# EAGLE design pmu (EAGLE 6.4)
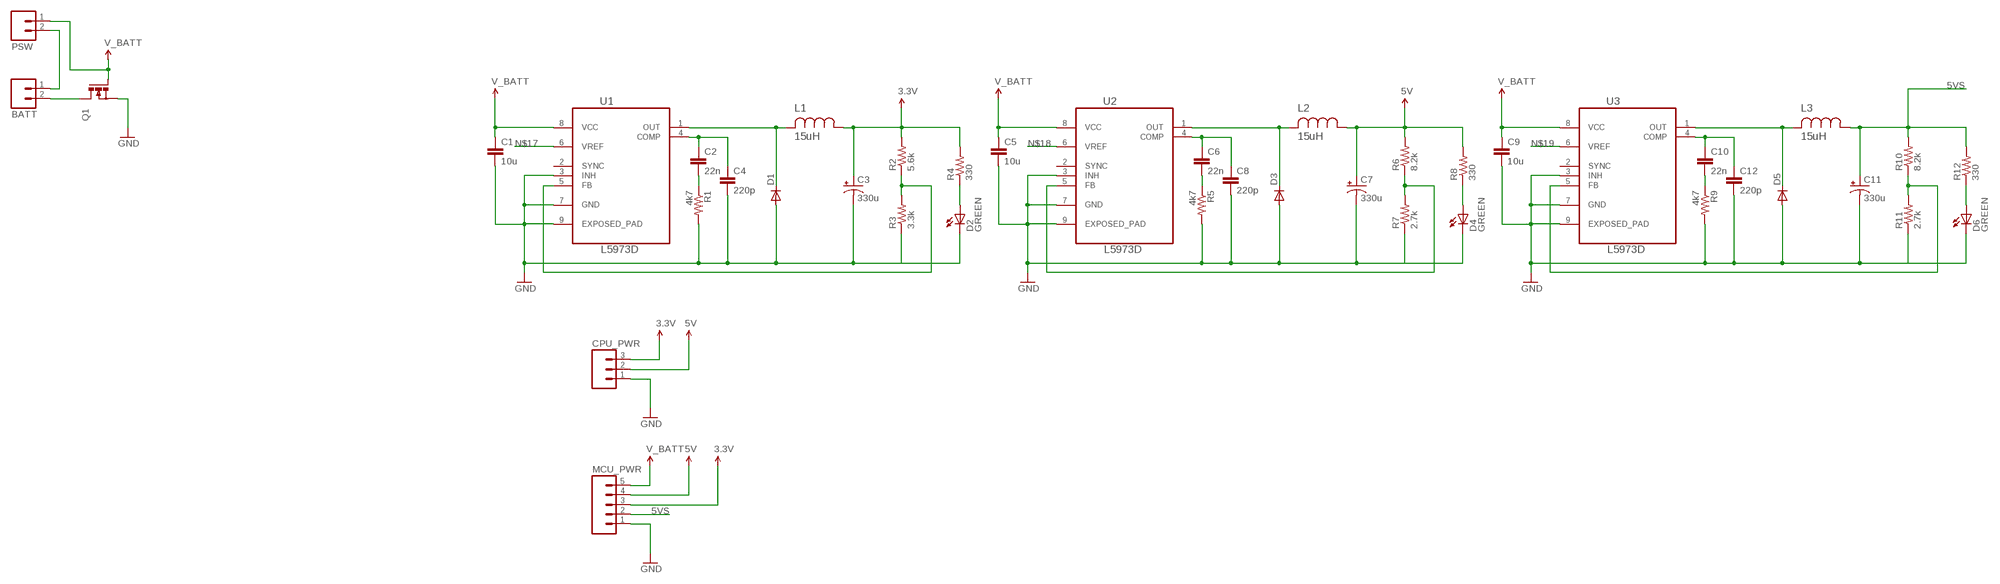
[diagram p0: schematic, sheet 1]

## Parts
BATT  M02PTH  [1X02]
C1  10u  CAP1210  [1210]
C2  22n  CAP0805  [0805]
C3  330u  CPOL-USE  [PANASONIC_E]
C4  220p  CAP0805  [0805]
C5  10u  CAP1210  [1210]
C6  22n  CAP0805  [0805]
C7  330u  CPOL-USE  [PANASONIC_E]
C8  220p  CAP0805  [0805]
C9  10u  CAP1210  [1210]
C10  22n  CAP0805  [0805]
C11  330u  CPOL-USE  [PANASONIC_E]
C12  220p  CAP0805  [0805]
CPU_PWR  M03PTH  [1X03]
D1  DIODESMB  [SMB-DIODE]
D2  GREEN  LED-GREENLARGE  [LED-1206]
D3  DIODESMB  [SMB-DIODE]
D4  GREEN  LED-GREENLARGE  [LED-1206]
D5  DIODESMB  [SMB-DIODE]
D6  GREEN  LED-GREENLARGE  [LED-1206]
L1  15uH  ELL8TP150MB-8TP  [IND_ELL8TP]
L2  15uH  ELL8TP150MB-8TP  [IND_ELL8TP]
L3  15uH  ELL8TP150MB-8TP  [IND_ELL8TP]
MCU_PWR  M05PTH  [1X05]
PSW  M02PTH  [1X02]
Q1  N-MOSFET-SO8S  [SO-08]
R1  4k7  RESISTOR0805-RES  [0805]
R2  5.6k  RESISTOR0805-RES  [0805]
R3  3.3k  RESISTOR0805-RES  [0805]
R4  330  RESISTOR0805-RES  [0805]
R5  4k7  RESISTOR0805-RES  [0805]
R6  8.2k  RESISTOR0805-RES  [0805]
R7  2.7k  RESISTOR0805-RES  [0805]
R8  330  RESISTOR0805-RES  [0805]
R9  4k7  RESISTOR0805-RES  [0805]
R10  8.2k  RESISTOR0805-RES  [0805]
R11  2.7k  RESISTOR0805-RES  [0805]
R12  330  RESISTOR0805-RES  [0805]
U1  L5973D  [SOP127P600X170-9N]
U2  L5973D  [SOP127P600X170-9N]
U3  L5973D  [SOP127P600X170-9N]

## Nets
3.3V: C3.+ CPU_PWR.3 L1.1 MCU_PWR.3 R2.2 R4.2
5V: C7.+ CPU_PWR.2 L2.1 MCU_PWR.4 R6.2 R8.2
5VS: C11.+ L3.1 MCU_PWR.2 R10.2 R12.2
GND: C1.2 C3.- C4.2 C5.2 C7.- C8.2 C9.2 C11.- C12.2 CPU_PWR.1 D1.A D2.C D3.A D4.C D5.A D6.C MCU_PWR.1 Q1.1(S) Q1.2(S) Q1.3(S) R1.2 R3.1 R5.2 R7.1 R9.2 R11.1 U1.3(INH) U1.7(GND) U1.9(EXPOSED_PAD) U2.3(INH) U2.7(GND) U2.9(EXPOSED_PAD) U3.3(INH) U3.7(GND) U3.9(EXPOSED_PAD)
N$1: C2.1 C4.1 U1.4(COMP)
N$2: C2.2 R1.1
N$3: D1.C L1.2 U1.1(OUT)
N$4: BATT.2 Q1.5(D) Q1.6(D) Q1.7(D) Q1.8(D)
N$5: R2.1 R3.2 U1.5(FB)
N$6: D2.A R4.1
N$7: C10.1 C12.1 U3.4(COMP)
N$8: C6.1 C8.1 U2.4(COMP)
N$9: C6.2 R5.1
N$10: D3.C L2.2 U2.1(OUT)
N$11: R6.1 R7.2 U2.5(FB)
N$12: D4.A R8.1
N$13: C10.2 R9.1
N$14: D5.C L3.2 U3.1(OUT)
N$15: R10.1 R11.2 U3.5(FB)
N$16: D6.A R12.1
N$17: U1.6(VREF)
N$18: U2.6(VREF)
N$19: U3.6(VREF)
N$22: BATT.1 PSW.2
V_BATT: C1.1 C5.1 C9.1 MCU_PWR.5 PSW.1 Q1.4(G) U1.8(VCC) U2.8(VCC) U3.8(VCC)
Unconnected: U1.2(SYNC) U2.2(SYNC) U3.2(SYNC)

## Library data of the parts
BATT PSW = SparkFun-Connectors:M02: Standard 2-pin 0.1" header. Use with - straight break away headers ( PRT-00116) - right angle break away headers (PRT-00553) - swiss pins (PRT-00743) - machine pins (PRT-00117) - female headers (PRT-00115) Molex polarized connector foot print use with: PRT-08233 with associated crimp pins and housings. 2.54_SCREWTERM for use with PRT-10571. 3.5mm Screw Terminal footprints for PRT-08084 5mm Screw Terminal footprints for use with PRT-08433
C1 C2 C4-C6 C8-C10 C12 = SparkFun-Passives:CAP: Capacitor Standard 0603 ceramic capacitor, and 0.1" leaded capacitor.
C3 C7 C11 = rcl:CPOL-US: POLARIZED CAPACITOR, American symbol
CPU_PWR = SparkFun-Connectors:M03: Header 3 Standard 3-pin 0.1" header. Use with straight break away headers (SKU : PRT-00116), right angle break away headers (PRT-00553), swiss pins (PRT-00743), machine pins (PRT-00117), and female headers (PRT-00115). Molex polarized connector foot print use with SKU : PRT-08232 with associated crimp pins and housings.
D1 D3 D5 = SparkFun-DiscreteSemi:DIODE: Diode These are standard reverse protection diodes and small signal diodes. SMA package can handle up to about 1A. SOD-323 can handle about 200mA. What the SOD-323 package when ordering, there are some mfgs out there that are 5-pin packages.
D2 D4 D6 = SparkFun-LED:LED-GREEN: Various green LEDs 0603- DIO-00821 LARGE- DIO-00862 LILYPAD- DIO-09910; PROD_ID: DIO-00862
L1-L3 = Panasonic-ELL:ELL: Choke Coils; CURRENTRATING: 2.3A; MPN: ELL8TP150MB; OC_FARNELL: 1865673; OC_NEWARK: 56T0928; PACKAGE: SMD; SUPPLIER: PANASONIC; VALUE: 15UH
MCU_PWR = SparkFun-Connectors:M05: Header 5 Standard 5-pin 0.1" header. Use with straight break away headers (SKU : PRT-00116), right angle break away headers (PRT-00553), swiss pins (PRT-00743), machine pins (PRT-00117), and female headers (PRT-00115). Molex polarized connector foot print use with SKU : PRT-08230 with associated crimp pins and housings.
Q1 = transistor-power:N-MOSFET-SO8: N-Channel MOSFET Example: FDS7760A; N-Channel Logic Level PowerTrench® MOSFET FDS2572; N-Channel UltraFET® Trench MOSFET Source: www.fairchildsemi.com
R1-R12 = SparkFun-Passives:RESISTOR: Resistor Basic schematic elements and footprints for 0603, 1206, and PTH resistors.
U1-U3 = L5973D:L5973D: 2.5 A switch step down switching regulator; MPN: L5973D; OC_FARNELL: 1077145; OC_NEWARK: 05M3335; PACKAGE: HSOP8; SUPPLIER: STMICROELECTRONICS

## Board
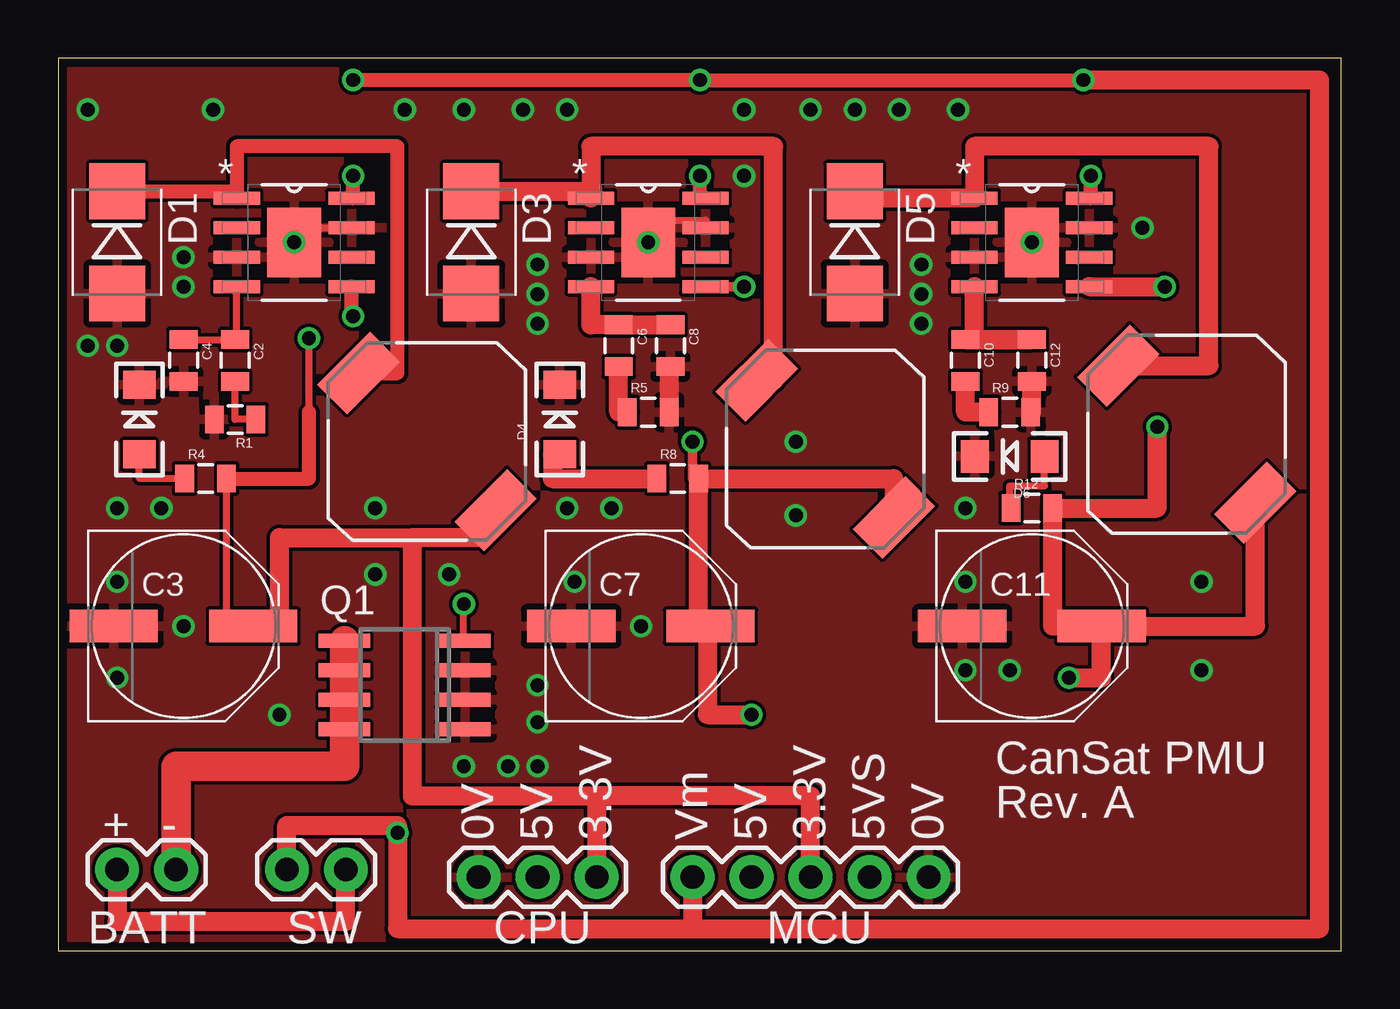
[diagram p1: board, top side]
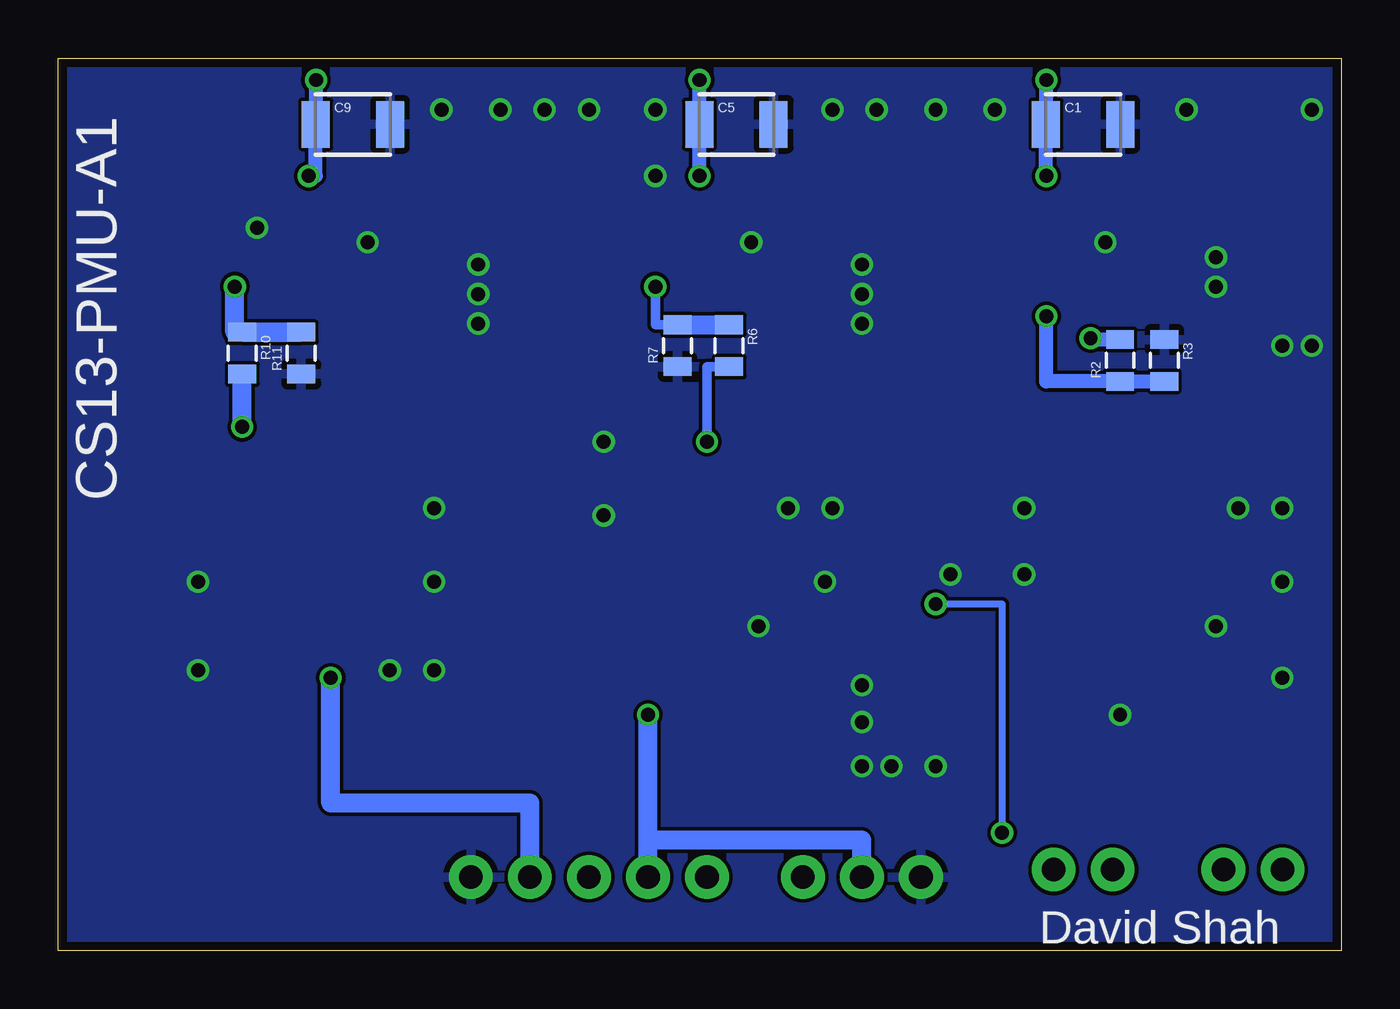
[diagram p2: board, bottom side, seen from below]

Size 55.23 x 38.41 mm. Coordinates in mm from the lower left corner, seen from the top.
Outline: 0,0 55.23,0 55.23,38.41 0,38.41 0,0
Copper layers (1*16): Top 0.0356mm / dielectric 1.5011mm / Bottom 0.0356mm
Design rules "LaenPCBOrder *": minimum track width 6mil, minimum drill 13mil, track to track 6mil, track to pad 6mil, pad to pad 6mil, via to via 6mil, smd to smd 6mil, copper to edge 15mil, drill to drill 6mil, minimum pad ring 7mil, minimum via ring 7mil, stop-mask expansion 4mil, vias tented up to drill 28mil, thermal gap 10mil

### Footprints (pad centres in the part's own frame; a part is rotated, then mirrored left to right if it is on the bottom)
1X02 = drill 1.016 pad 1.88: 1 0,0; 2 2.54,0
1210 = smd 1.2 x 2: 1 -1.6,0; 2 1.6,0
0805 = smd 0.8 x 1.2: 1 -0.9,0; 2 0.9,0
PANASONIC_E = smd 3.8 x 1.4: + 3,0; - -3,0
1X03 = drill 1.016 pad 1.88: 1 0,0; 2 2.54,0; 3 5.08,0
SMB-DIODE = smd 2.4 x 2.4: A 2.2,0; C -2.2,0
LED-1206 = smd 1.2 x 1.4: A -1.5,0; C 1.5,0
IND_ELL8TP = smd 1.8 x 3.2 rotated 45: 1 -2.95,-2.95; 2 2.95,2.95
1X05 = drill 1.016 pad 1.88: 1 0,0; 2 2.54,0; 3 5.08,0; 4 7.62,0; 5 10.16,0
SO-08 = smd 0.6 x 2.2: 1 -1.905,-2.6; 2 -0.635,-2.6; 3 0.635,-2.6; 4 1.905,-2.6; 5 1.905,2.6; 6 0.635,2.6; 7 -0.635,2.6; 8 -1.905,2.6
SOP127P600X170-9N = smd 1.981 x 0.559: 1 -2.464,1.905; 2 -2.464,0.635; 3 -2.464,-0.635; 4 -2.464,-1.905; 5 2.464,-1.905; 6 2.464,-0.635; 7 2.464,0.635; 8 2.464,1.905 | smd 2.311 x 2.997: 9 0,0

### Placement (x,y rotation side)
BATT  2.54,3.49 0 top
C1  11.11,35.56 0 bottom
C2  7.62,25.4 270 top
C3  5.4,13.97 0 top
C4  5.4,25.4 270 top
C5  26.04,35.56 0 bottom
C6  24.13,26.04 270 top
C7  25.08,13.97 0 top
C8  26.35,26.04 270 top
C9  42.55,35.56 0 bottom
C10  39.05,25.4 270 top
C11  41.91,13.97 0 top
C12  41.91,25.4 270 top
CPU_PWR  18.1,3.17 0 top
D1  2.54,30.48 270 top
D2  3.49,22.86 90 top
D3  17.78,30.48 270 top
D4  21.59,22.86 90 top
D5  34.29,30.48 270 top
D6  40.96,21.27 180 top
L1  15.88,21.91 90 top
L2  33.02,21.59 90 top
L3  48.58,22.23 90 top
MCU_PWR  37.47,3.17 180 top
PSW  9.84,3.49 0 top
Q1  14.92,11.43 90 top
R1  7.62,22.86 180 top
R2  9.53,25.4 90 bottom
R3  7.62,25.4 270 bottom
R4  6.35,20.32 0 top
R5  25.4,23.18 0 top
R6  26.35,26.04 270 bottom
R7  28.57,26.04 90 bottom
R8  26.67,20.32 0 top
R9  40.96,23.18 0 top
R10  47.31,25.72 270 bottom
R11  44.77,25.72 90 bottom
R12  41.91,19.05 0 top
U1  10.16,30.48 0 top
U2  25.4,30.48 0 top
U3  41.91,30.48 0 top

### Tracks (layer width: path | path; a pad name or v marks a point on that pad's centre or on a via)
3.3V  (via drill 0.6)
  Top 0.305: C3.+ 7.25,13.97 R4.2 | 10.79,23.18 v10.79,26.35
  Top 0.61: R4.2 10.79,20.32 10.79,23.18
  Top 0.813: C3.+ 9.53,13.97 9.53,17.78 15.24,17.78 | L1.1 18.19,17.78 15.24,17.78 | 15.24,17.78 15.24,6.67 23.18,6.67 | 23.18,6.67 CPU_PWR.3 | MCU_PWR.3 32.38,6.67 23.18,6.67
  Bottom 0.61: R2.2 10.79,26.3 v10.79,26.35
5V  (via drill 0.6)
  Top 0.406: R8.2 27.3,20.32 v27.3,21.91
  Top 0.813: L2.1 35.97,20.32 R8.2 27.57,13.97 C7.+ 27.94,13.97 27.94,10.16 v29.84,10.16
  Bottom 0.406: R6.2 27.3,25.14 v27.3,21.91
  Bottom 0.813: MCU_PWR.4 29.84,4.76 | 29.84,4.76 v29.84,10.16 | CPU_PWR.2 20.64,4.76 29.84,4.76
5VS  (via drill 0.6)
  Top 0.813: v43.5,11.75 44.91,11.75 C11.+ | C11.+ 51.53,13.97 L3.1 | C11.+ 42.81,13.97 R12.2 47.31,19.05 v47.31,22.54
  Bottom 0.813: MCU_PWR.2 34.92,6.35 43.5,6.35 v43.5,11.75 | v47.31,22.54 R10.2
GND  (via drill 0.6)
  Top 0.305: 9.53,29.53 9.53,30.48 U1.9 10.16,31.11 U1.7 | U2.7 27.86,31.43 26.04,31.43 26.04,30.48 U2.9 | U3.9 41.27,30.48 41.27,29.53
  Top 0.813: R9.2 41.91,23.18 C12.2 | C8.2 26.3,25.14 R5.2
  other vias: 10.16,30.48 25.4,30.48 41.91,30.48 2.54,19.05 4.45,19.05 21.91,19.05 23.81,19.05 39.05,19.05 1.27,36.2 6.67,36.2 14.92,36.2 17.46,36.2 20,36.2 21.91,36.2 29.53,36.2 32.38,36.2 34.29,36.2 36.2,36.2 38.73,36.2 37.15,29.53 37.15,28.26 37.15,26.99 29.53,33.34 20.64,28.26 20.64,29.53 20.64,26.99 17.46,7.94 20.64,7.94 19.37,7.94 46.67,31.11 31.75,21.91 31.75,18.73 1.27,26.04 2.54,26.04 5.4,29.84 5.4,28.57 5.4,13.97 2.54,15.88 2.54,11.75 9.53,10.16 13.65,19.05 13.65,16.19 16.83,16.19 20.64,9.84 20.64,11.43 22.23,15.88 39.05,15.88 39.05,12.06 40.96,12.06 25.08,13.97 49.21,15.88 49.21,12.06
  pour Top: -0.32,39.05 -0.32,-0.64 55.56,-0.64 55.56,39.05
  pour Bottom: -1.91,40.01 -1.91,-2.86 57.78,-2.86 57.78,40.01
N$1
  Top 0.305: C4.1 C2.1 7.7,26.3 U1.4
N$2
  Top 0.305: R1.1 7.62,22.86 C2.2
N$3
  Top 0.61: D1.C 7.7,32.68 U1.1 7.7,34.61 14.61,34.61 14.61,24.86 L1.2
N$4
  Top 1.27: BATT.2 5.08,7.94 12.32,7.94 Q1.8 Q1.7 Q1.6 Q1.5
N$5  (via drill 0.6)
  Top 0.61: v12.7,27.3 12.62,27.3 U1.5
  Bottom 0.61: v12.7,27.3 12.7,24.5 R2.1 R3.2
N$6
  Top 0.305: R4.1 3.49,20.32 D2.A
N$7
  Top 0.813: C10.1 C12.1 39.45,26.3 U3.4
N$8
  Top 0.813: U2.4 22.94,26.93 C6.1 C8.1
N$9
  Top 0.813: R5.1 24.13,23.18 C6.2
N$10
  Top 0.813: D3.C 22.94,32.68 U2.1 22.94,34.61 30.8,34.61 30.8,24.54 L2.2
N$11  (via drill 0.6)
  Top 0.406: U2.5 v29.53,28.57
  Bottom 0.406: R6.1 29.53,26.93 v29.53,28.57
  Bottom 0.813: R7.2 R6.1
N$12
  Top 0.813: D4.A 21.27,21.36 21.27,20.32 R8.1
N$13
  Top 0.813: R9.1 39.05,23.18 C10.2
N$14
  Top 0.813: L3.2 49.53,25.18 49.53,34.61 39.45,34.61 U3.1 34.29,32.38 D5.C
N$15  (via drill 0.6)
  Top 0.813: U3.5 v47.62,28.57
  Bottom 0.813: R10.1 R11.2 47.62,26.62 v47.62,28.57
N$16
  Top 0.305: R12.1 40.96,19.05 40.96,20 42.46,20 D6.A
N$22
  Top 0.813: BATT.1 2.54,1.27 12.38,1.27 PSW.2
V_BATT  (via drill 0.6)
  Top 0.305: Q1.4 17.46,13.34 v17.46,14.92
  Top 0.61: U1.8 12.7,32.38 v12.7,33.34 | U2.8 27.62,32.38 v27.62,33.34 | v12.7,37.47 v27.62,37.47 v44.13,37.47 | U3.8 44.45,32.38 v44.45,33.34
  Top 0.813: PSW.1 9.84,5.4 14.61,5.4 v14.61,5.08 14.61,0.95 27.3,0.95 | 27.3,0.95 54.29,0.95 54.29,37.47 v44.13,37.47 | MCU_PWR.5 27.3,0.95
  Bottom 0.305: v17.46,14.92 14.61,14.92 v14.61,5.08
  Bottom 0.61: v12.7,33.34 12.71,33.34 C1.1 v12.7,37.47 | v27.62,33.34 27.64,33.34 C5.1 27.62,35.56 v27.62,37.47 | v44.45,33.34 44.15,33.34 C9.1 44.13,35.56 v44.13,37.47

### Text on the board
tNames: CanSat PMU | Rev. A | + | - | 0V | 5V | 3.3V | Vm | 5V | 3.3V | 5VS | 0V | BATT | SW | CPU | MCU
bNames: CS13-PMU-A1 | David Shah